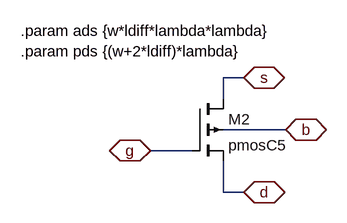
[diagram p0: schematic CMOSP.asc]
CMOSP.asc, the LTspice schematic file:
Version 4
SHEET 1 1648 680
WIRE 240 144 208 144
WIRE 208 176 208 144
WIRE 304 224 208 224
WIRE 160 256 96 256
WIRE 208 320 208 272
WIRE 240 320 208 320
FLAG 96 256 g
IOPIN 96 256 BiDir
FLAG 240 320 d
IOPIN 240 320 BiDir
FLAG 240 144 s
IOPIN 240 144 BiDir
FLAG 304 224 b
IOPIN 304 224 BiDir
SYMBOL pmos4 160 176 R0
SYMATTR InstName M2
SYMATTR Value pmosC5
SYMATTR Value2 l={l*lambda} w={w*lambda} ad={ads} as={ads} pd={pds} ps={pds} m={m}
TEXT -104 72 Left 2 !.param ads {w*ldiff*lambda*lambda}\n.param pds {(w+2*ldiff)*lambda}

The netlist it stands for:
* CMOSP.asc
M2 s g d b pmosC5 l={l*lambda} w={w*lambda} ad={ads} as={ads} pd={pds} ps={pds} m={m}
.model NMOS NMOS
.model PMOS PMOS
.lib standard.mos
.param ads {w*ldiff*lambda*lambda}
.param pds {(w+2*ldiff)*lambda}
.backanno
.end